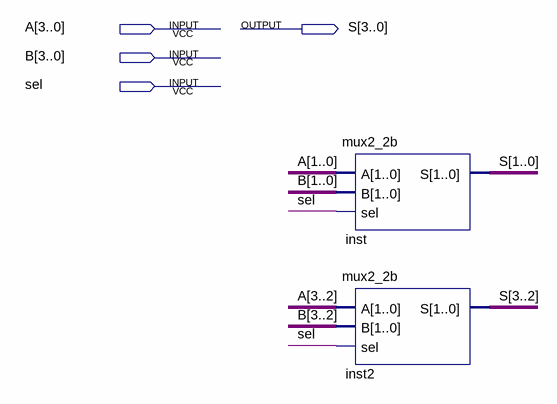
[diagram p0: schematic sheet]
// Quartus schematic mux2_4b.bdf as structural Verilog: 2 symbols, 4 pins
module mux2_4b (
  input  [3:0] A,
  input  [3:0] B,
  input  sel,
  output [3:0] S
);

  mux2_2b inst (.A(A[1:0]), .B(B[1:0]), .sel(sel), .S(S[1:0]));
  mux2_2b inst2 (.A(A[3:2]), .B(B[3:2]), .sel(sel), .S(S[3:2]));
endmodule
